# Altium schematic sheet Overview.SchDoc
size A; SheetNumber: 1; SheetTotal: 6
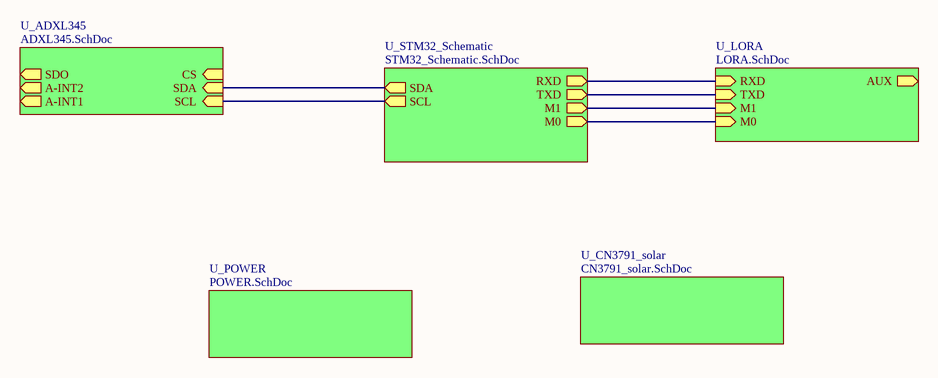
[diagram p0: Overview.SchDoc]

## Sub-sheets
U_ADXL345 = ADXL345.SchDoc: SCL (in), SDA (in), A-INT1 (out), A-INT2 (out), SDO (out), CS (in)
U_CN3791_solar = CN3791_solar.SchDoc: no entries
U_LORA = LORA.SchDoc: AUX (out), RXD (in), TXD (in), M0 (in), M1 (in)
U_POWER = POWER.SchDoc: no entries
U_STM32_Schematic = STM32_Schematic.SchDoc: RXD (out), TXD (out), M1 (out), M0 (out), SDA (out), SCL (out)

## Nets
(unnamed): sheet U_STM32_Schematic/RXD, sheet U_LORA/RXD
(unnamed): sheet U_STM32_Schematic/TXD, sheet U_LORA/TXD
(unnamed): sheet U_STM32_Schematic/M1, sheet U_LORA/M1
(unnamed): sheet U_STM32_Schematic/M0, sheet U_LORA/M0
(unnamed): sheet U_STM32_Schematic/SDA, sheet U_ADXL345/SDA
(unnamed): sheet U_STM32_Schematic/SCL, sheet U_ADXL345/SCL